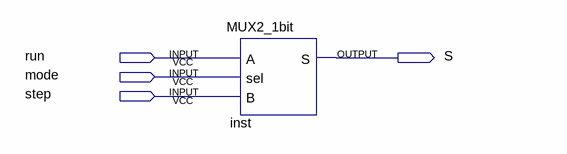
[diagram p0: schematic sheet]
// Quartus schematic runStep.bdf as structural Verilog: 1 symbols, 4 pins
module runStep (
  input  run,
  input  mode,
  input  step,
  output S
);

  MUX2_1bit inst (.A(run), .sel(mode), .B(step), .S(S));
endmodule
